# EAGLE schematic sFPI-Driver (EAGLE 7.3.0)
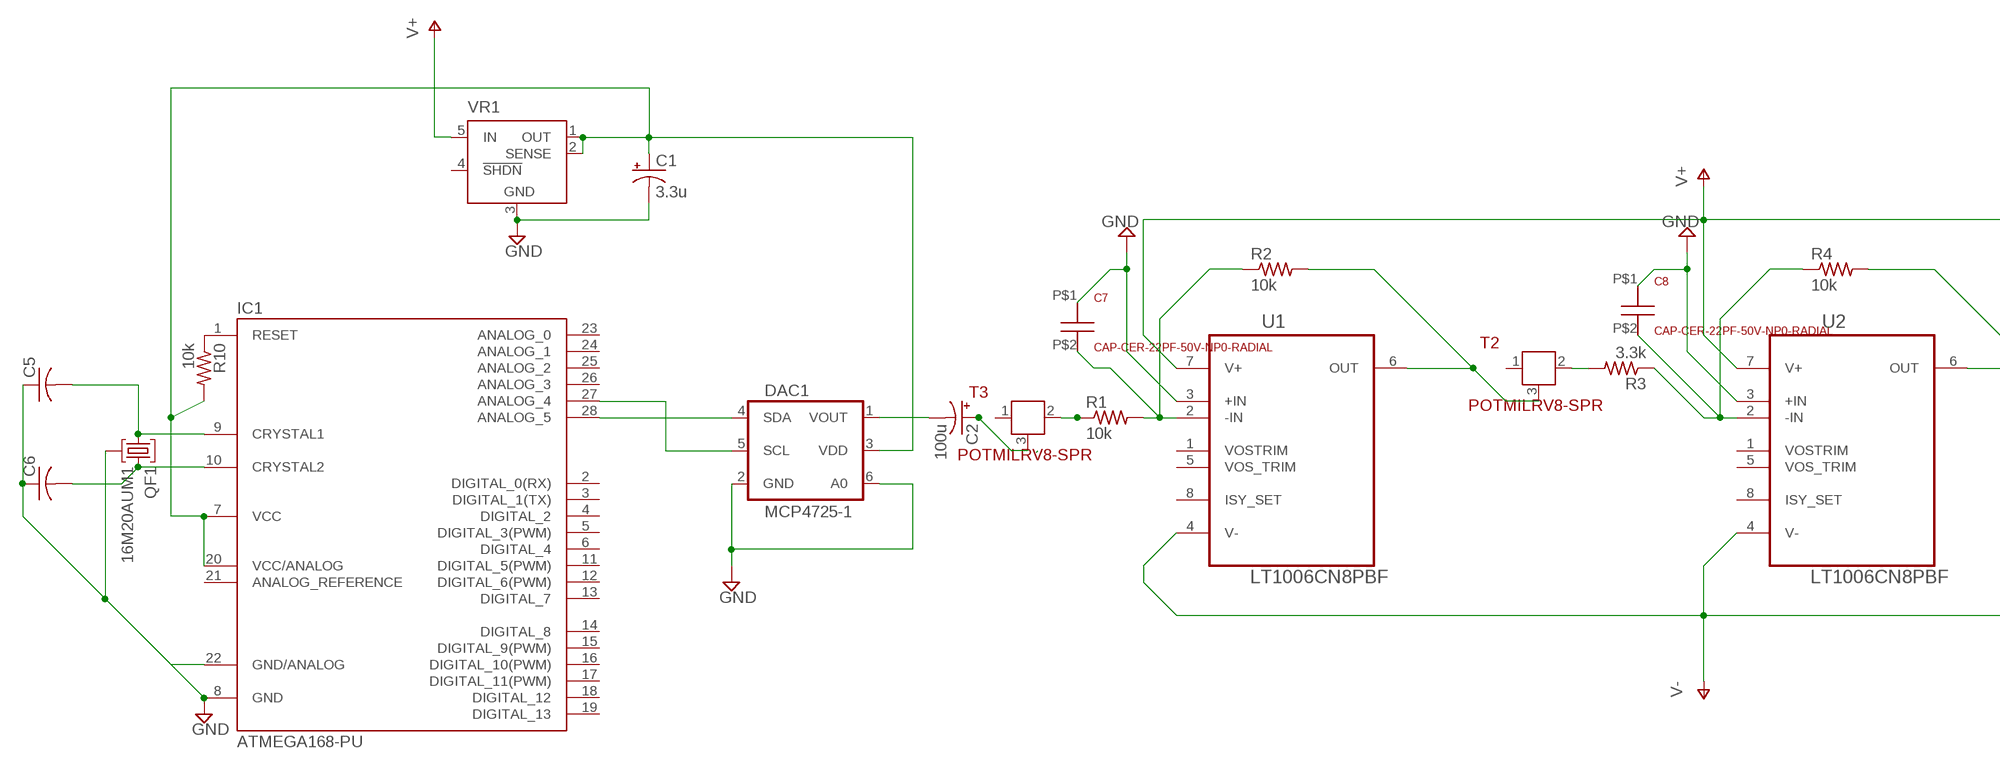
[diagram p0: schematic, sheet 1, part 1 of 2]
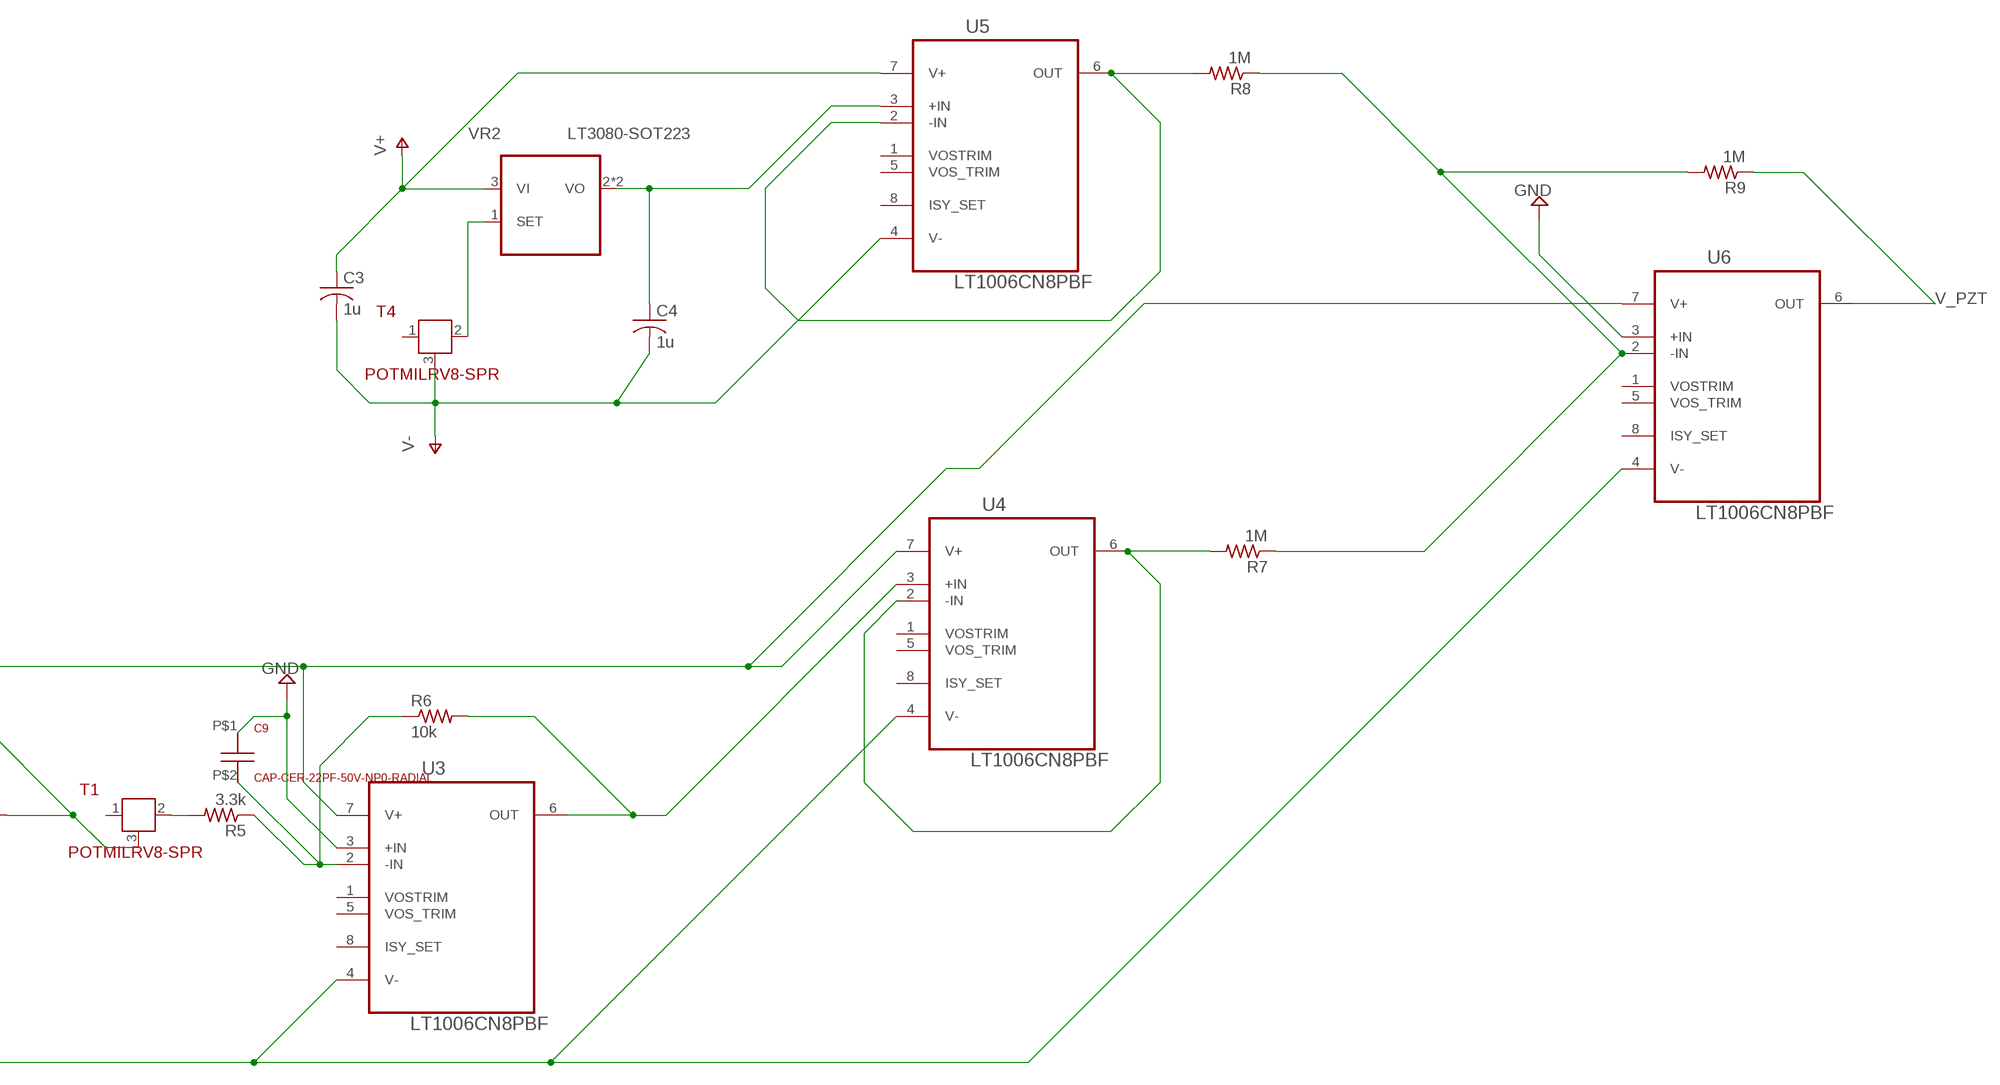
[diagram p1: schematic, sheet 1, part 2 of 2]

## Parts
C1  3.3u  CPOL-USCT3216  [CT3216]
C2  100u  CPOL-USC  [PANASONIC_C]
C3  1u  C-US050-030X075  [C050-030X075]
C4  1u  C-US050-030X075  [C050-030X075]
C5  C-US025-024X044  [C025-024X044]
C6  C-US025-024X044  [C025-024X044]
C7  CAP-CER-22PF-50V-NP0-RADIAL  [FG28]
C8  CAP-CER-22PF-50V-NP0-RADIAL  [FG28]
C9  CAP-CER-22PF-50V-NP0-RADIAL  [FG28]
DAC1  MCP4725-1  [SOT23-6]
IC1  ATMEGA168-PU  [DIL28-3]
QF1  16M20AUM1  [UM1]
R1  10k  R-US_0207/10  [0207/10]
R2  10k  R-US_0207/10  [0207/10]
R3  3.3k  R-US_M1206  [M1206]
R4  10k  R-US_0207/10  [0207/10]
R5  3.3k  R-US_M1206  [M1206]
R6  10k  R-US_0207/10  [0207/10]
R7  1M  R-US_M1206  [M1206]
R8  1M  R-US_M1206  [M1206]
R9  1M  R-US_M1206  [M1206]
R10  10k  R-US_M1206  [M1206]
T1  POTMILRV8-SPR  [SPR]
T2  POTMILRV8-SPR  [SPR]
T3  POTMILRV8-SPR  [SPR]
T4  POTMILRV8-SPR  [SPR]
U1  LT1006CN8PBF  [DIP254P762X393-8]
U2  LT1006CN8PBF  [DIP254P762X393-8]
U3  LT1006CN8PBF  [DIP254P762X393-8]
U4  LT1006CN8PBF  [DIP254P762X393-8]
U5  LT1006CN8PBF  [DIP254P762X393-8]
U6  LT1006CN8PBF  [DIP254P762X393-8]
VR1  LT1129CQ-5  [Q5-DD]
VR2  LT3080-SOT223  [SOT223]

## Nets
GND: C1.- C5.1 C6.1 C7.P$1 C8.P$1 C9.P$1 DAC1.2(GND) DAC1.6(A0) IC1.8(GND) IC1.22(GND/ANALOG) QF1.2 U1.3(+IN) U2.3(+IN) U3.3(+IN) U6.3(+IN) VR1.3(GND)
N$1: C5.2 IC1.9(CRYSTAL1) QF1.1
N$2: C6.2 IC1.10(CRYSTAL2) QF1.3
N$3: IC1.1(RESET) R10.1
N$4: C1.+ DAC1.3(VDD) IC1.7(VCC) IC1.20(VCC/ANALOG) R10.2 VR1.1(OUT) VR1.2(SENSE)
N$5: R2.2 R4.2 T1.3 T2.3 U1.6(OUT)
N$6: C7.P$2 C8.P$2 R1.2 R2.1 R3.1 R4.1 U1.2(-IN)
N$7: DAC1.5(SCL) IC1.27(ANALOG_4)
N$8: DAC1.4(SDA) IC1.28(ANALOG_5)
N$9: C2.+ T3.3
N$10: R1.1 T3.2
N$11: C2.- DAC1.1(VOUT)
N$12: R3.2 T2.2
N$13: R5.2 T1.2
N$14: C9.P$2 R5.1 R6.1 U3.2(-IN)
N$16: R6.2 U3.6(OUT) U4.3(+IN)
N$17: R8.2 U5.2(-IN) U5.6(OUT)
N$18: U1.4(V-)
N$19: R7.1 R8.1 R9.2 U6.2(-IN)
N$20: C4.1 U5.3(+IN) VR2.2(VO) VR2.4(VO)
N$23: T4.2 VR2.1(SET)
N$24: R7.2 U4.2(-IN) U4.6(OUT)
V+: C3.1 U1.7(V+) U2.7(V+) U3.7(V+) U4.7(V+) U5.7(V+) U6.7(V+) VR1.5(IN) VR2.3(VI)
V-: C3.2 C4.2 T4.3 U2.4(V-) U3.4(V-) U4.4(V-) U5.4(V-) U6.4(V-)
V_PZT: R9.1 U6.6(OUT)
Unconnected: IC1.2(DIGITAL_0(RX)) IC1.3(DIGITAL_1(TX)) IC1.4(DIGITAL_2) IC1.5(DIGITAL_3(PWM)) IC1.6(DIGITAL_4) IC1.11(DIGITAL_5(PWM)) IC1.12(DIGITAL_6(PWM)) IC1.13(DIGITAL_7) IC1.14(DIGITAL_8) IC1.15(DIGITAL_9(PWM)) IC1.16(DIGITAL_10(PWM)) IC1.17(DIGITAL_11(PWM)) IC1.18(DIGITAL_12) IC1.19(DIGITAL_13) IC1.21(ANALOG_REFERENCE) IC1.23(ANALOG_0) IC1.24(ANALOG_1) IC1.25(ANALOG_2) IC1.26(ANALOG_3) T1.1 T2.1 T3.1 T4.1 U1.1(VOSTRIM) U1.5(VOS_TRIM) U1.8(ISY_SET) U2.1(VOSTRIM) U2.2(-IN) U2.5(VOS_TRIM) U2.6(OUT) U2.8(ISY_SET) U3.1(VOSTRIM) U3.5(VOS_TRIM) U3.8(ISY_SET) U4.1(VOSTRIM) U4.5(VOS_TRIM) U4.8(ISY_SET) U5.1(VOSTRIM) U5.5(VOS_TRIM) U5.8(ISY_SET) U6.1(VOSTRIM) U6.5(VOS_TRIM) U6.8(ISY_SET) VR1.4(!SHDN)

## Library data of the parts
C1 C2 = rcl:CPOL-US: POLARIZED CAPACITOR, American symbol
C3-C6 = rcl:C-US: CAPACITOR, American symbol
C7-C9 = sFPI:CAP-CER-22PF-50V-NP0-RADIAL
DAC1 = sFPI:MCP4725
IC1 = Arduino-AVR:ATMEGA168-PU
QF1 = crystal:16M20AUM1: Monolithic Crystal Filters Source: www.vanlong.com; OC_FARNELL: unknown; OC_NEWARK: unknown
R1-R10 = rcl:R-US_: RESISTOR, American symbol
T1-T4 = sFPI:POTMILRV8: Precision series SPR/RV8 potentiometers are for PCB applications requiring a rugged potentiometer.
U1-U6 = LTC:LT1006CN8PBF: Precision, Single Supply Op Amp; MPN: LT1006CN8#PBF; OC_FARNELL: 9559221; OC_NEWARK: 57M0722; PACKAGE: DIP-8; SUPPLIER: LTC
VR1 = linear-technology:LT1129CQ-5: VOLTAGE REGULATOR with shutdown; MPN: LT1129CQ-5#PBF; OC_FARNELL: 1663373; OC_NEWARK: 57M2058
VR2 = sFPI:LT3080